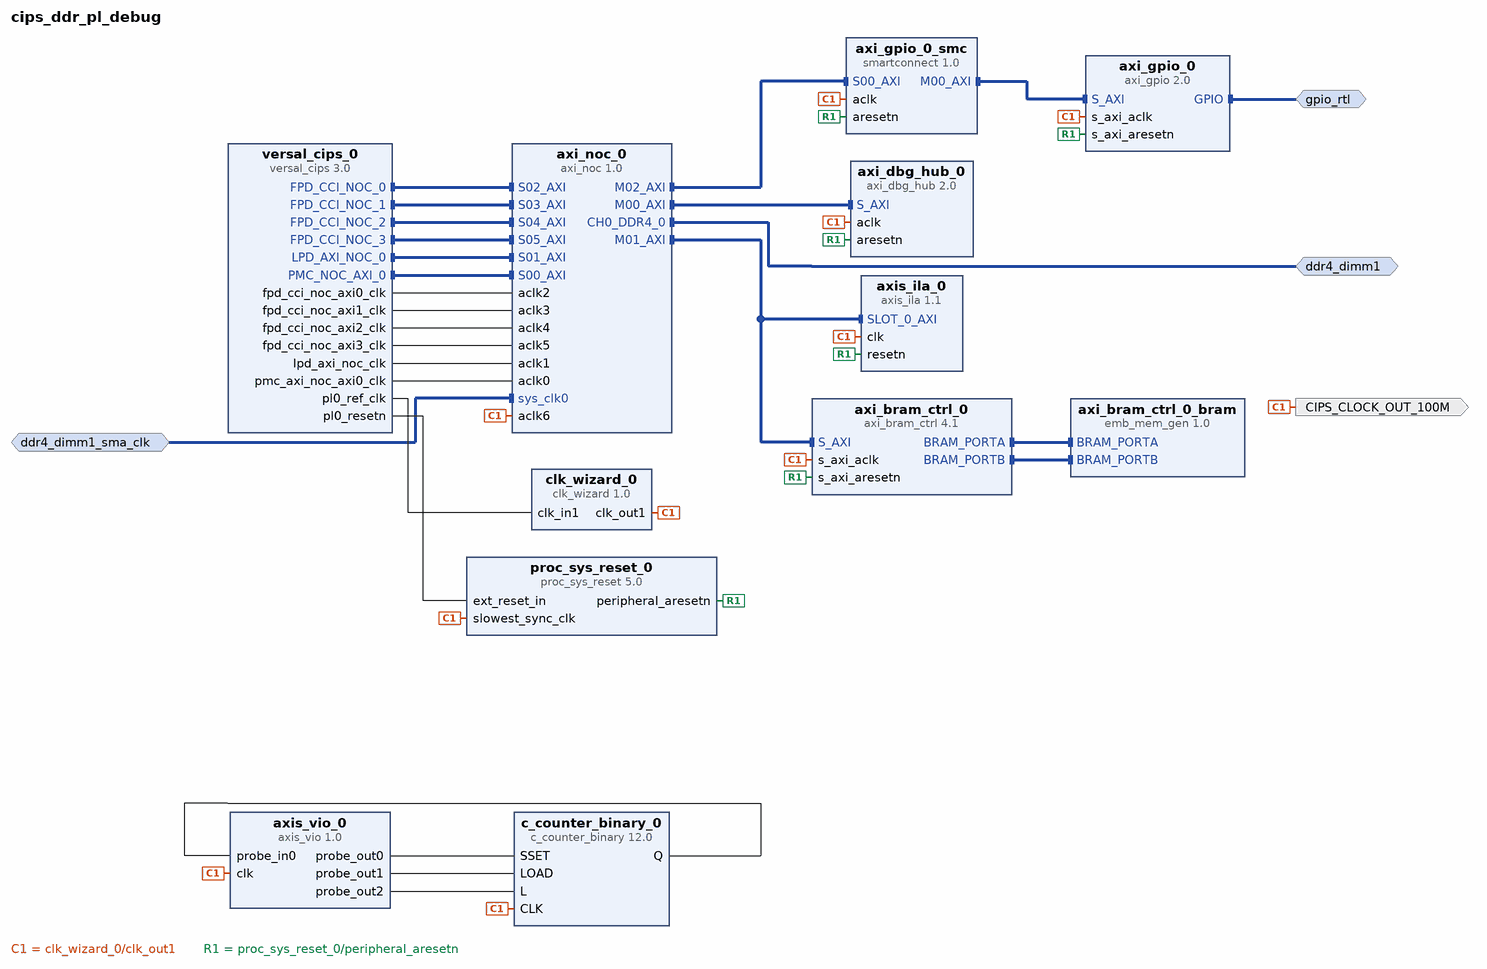
[diagram p0: block diagram of the top level]
# Vivado block design cips_ddr_pl_debug, xcvc1902-vsva2197-2MP-e-S, Vivado 2021.1
create_bd_design cips_ddr_pl_debug

create_bd_intf_port -mode Master -vlnv xilinx.com:interface:ddr4_rtl:1.0 ddr4_dimm1
create_bd_intf_port -mode Slave -vlnv xilinx.com:interface:diff_clock_rtl:1.0 ddr4_dimm1_sma_clk
set_property -dict {CONFIG.FREQ_HZ 200000000} [get_bd_intf_ports ddr4_dimm1_sma_clk]
create_bd_intf_port -mode Master -vlnv xilinx.com:interface:gpio_rtl:1.0 gpio_rtl
create_bd_port -dir O -type clk CIPS_CLOCK_OUT_100M

create_bd_cell -type ip -vlnv xilinx.com:ip:axi_bram_ctrl:4.1 axi_bram_ctrl_0
create_bd_cell -type ip -vlnv xilinx.com:ip:emb_mem_gen:1.0 axi_bram_ctrl_0_bram
set_property -dict {CONFIG.MEMORY_TYPE True_Dual_Port_RAM} [get_bd_cells axi_bram_ctrl_0_bram]
create_bd_cell -type ip -vlnv xilinx.com:ip:axi_dbg_hub:2.0 axi_dbg_hub_0
set_property -dict {CONFIG.C_AXI_DATA_WIDTH 128 CONFIG.C_NUM_DEBUG_CORES 0} [get_bd_cells axi_dbg_hub_0]
create_bd_cell -type ip -vlnv xilinx.com:ip:axi_noc:1.0 axi_noc_0
set_property -dict [list \
  CONFIG.CH0_DDR4_0_BOARD_INTERFACE ddr4_dimm1 \
  CONFIG.NUM_CLKS 7 \
  CONFIG.NUM_MI 3 \
  CONFIG.NUM_SI 6 \
  CONFIG.sys_clk0_BOARD_INTERFACE ddr4_dimm1_sma_clk \
] [get_bd_cells axi_noc_0]
create_bd_cell -type ip -vlnv xilinx.com:ip:axis_ila:1.1 axis_ila_0
set_property -dict [list \
  CONFIG.C_MON_TYPE Interface_Monitor \
  CONFIG.C_SLOT_0_APC_EN 0 \
  CONFIG.C_SLOT_0_AXI_AR_SEL_DATA 1 \
  CONFIG.C_SLOT_0_AXI_AR_SEL_TRIG 1 \
  CONFIG.C_SLOT_0_AXI_AW_SEL_DATA 1 \
  CONFIG.C_SLOT_0_AXI_AW_SEL_TRIG 1 \
  CONFIG.C_SLOT_0_AXI_B_SEL_DATA 1 \
  CONFIG.C_SLOT_0_AXI_B_SEL_TRIG 1 \
  CONFIG.C_SLOT_0_AXI_R_SEL_DATA 1 \
  CONFIG.C_SLOT_0_AXI_R_SEL_TRIG 1 \
  CONFIG.C_SLOT_0_AXI_W_SEL_DATA 1 \
  CONFIG.C_SLOT_0_AXI_W_SEL_TRIG 1 \
] [get_bd_cells axis_ila_0]
create_bd_cell -type ip -vlnv xilinx.com:ip:axis_vio:1.0 axis_vio_0
set_property -dict {CONFIG.C_NUM_PROBE_OUT 3 CONFIG.C_PROBE_IN0_WIDTH 16 CONFIG.C_PROBE_OUT2_WIDTH 16} [get_bd_cells axis_vio_0]
create_bd_cell -type ip -vlnv xilinx.com:ip:c_counter_binary:12.0 c_counter_binary_0
set_property -dict {CONFIG.Load true CONFIG.SSET true} [get_bd_cells c_counter_binary_0]
create_bd_cell -type ip -vlnv xilinx.com:ip:clk_wizard:1.0 clk_wizard_0
set_property -dict {CONFIG.PRIM_SOURCE No_buffer} [get_bd_cells clk_wizard_0]
create_bd_cell -type ip -vlnv xilinx.com:ip:proc_sys_reset:5.0 proc_sys_reset_0
create_bd_cell -type ip -vlnv xilinx.com:ip:versal_cips:3.0 versal_cips_0
set_property -dict [list \
  CONFIG.CLOCK_MODE Custom \
  CONFIG.DDR_MEMORY_MODE Custom \
  CONFIG.PS_BOARD_INTERFACE ps_pmc_fixed_io \
  CONFIG.PS_PMC_CONFIG {PS_GEN_IPI0_ENABLE 1 PS_GEN_IPI0_MASTER A72 PS_GEN_IPI1_ENABLE 1 PS_GEN_IPI1_MASTER A72 PS_GEN_IPI2_ENABLE 1 PS_GEN_IPI2_MASTER A72 PS_GEN_IPI3_ENABLE 1 PS_GEN_IPI3_MASTER A72 PS_GEN_IPI4_ENABLE 1 PS_GEN_IPI4_MASTER A72 PS_GEN_IPI5_ENABLE 1 PS_GEN_IPI5_MASTER A72 PS_GEN_IPI6_ENABLE 1 PS_GEN_IPI6_MASTER A72 CLOCK_MODE Custom DDR_MEMORY_MODE Custom PMC_USE_PMC_NOC_AXI0 1 PS_NUM_FABRIC_RESETS 1 PS_USE_FPD_CCI_NOC 1 PS_USE_NOC_LPD_AXI0 1 PS_USE_PMCPL_CLK0 1 PS_MIO7 {{AUX_IO 0} {DIRECTION in} {DRIVE_STRENGTH 8mA} {OUTPUT_DATA default} {PULL disable} {SCHMITT 0} {SLEW slow} {USAGE Reserved}} PS_MIO9 {{AUX_IO 0} {DIRECTION in} {DRIVE_STRENGTH 8mA} {OUTPUT_DATA default} {PULL disable} {SCHMITT 0} {SLEW slow} {USAGE Reserved}} PS_MIO19 {{AUX_IO 0} {DIRECTION in} {DRIVE_STRENGTH 8mA} {OUTPUT_DATA default} {PULL disable} {SCHMITT 0} {SLEW slow} {USAGE Reserved}} PS_MIO21 {{AUX_IO 0} {DIRECTION in} {DRIVE_STRENGTH 8mA} {OUTPUT_DATA default} {PULL disable} {SCHMITT 0} {SLEW slow} {USAGE Reserved}} PMC_MIO37 {{AUX_IO 0} {DIRECTION out} {DRIVE_STRENGTH 8mA} {OUTPUT_DATA high} {PULL pullup} {SCHMITT 0} {SLEW slow} {USAGE GPIO}} PMC_SD1 {{CD_ENABLE 1} {CD_IO {PMC_MIO 28}} {POW_ENABLE 1} {POW_IO {PMC_MIO 51}} {RESET_ENABLE 0} {RESET_IO {PMC_MIO 1}} {WP_ENABLE 0} {WP_IO {PMC_MIO 1}}} PMC_SD1_COHERENCY 0 PMC_SD1_DATA_TRANSFER_MODE 8Bit PMC_SD1_PERIPHERAL {{ENABLE 1} {IO {PMC_MIO 26 .. 36}}} PMC_SD1_SLOT_TYPE {SD 3.0} PMC_GPIO0_MIO_PERIPHERAL {{ENABLE 1} {IO {PMC_MIO 0 .. 25}}} PMC_GPIO1_MIO_PERIPHERAL {{ENABLE 1} {IO {PMC_MIO 26 .. 51}}} PMC_I2CPMC_PERIPHERAL {{ENABLE 1} {IO {PMC_MIO 46 .. 47}}} PMC_OSPI_PERIPHERAL {{ENABLE 0} {IO {PMC_MIO 0 .. 11}} {MODE Single}} PMC_QSPI_COHERENCY 0 PMC_QSPI_FBCLK {{ENABLE 1} {IO {PMC_MIO 6}}} PMC_QSPI_PERIPHERAL_DATA_MODE x4 PMC_QSPI_PERIPHERAL_ENABLE 1 PMC_QSPI_PERIPHERAL_MODE {Dual Parallel} PS_CAN1_PERIPHERAL {{ENABLE 1} {IO {PMC_MIO 40 .. 41}}} PS_ENET0_MDIO {{ENABLE 1} {IO {PS_MIO 24 .. 25}}} PS_ENET0_PERIPHERAL {{ENABLE 1} {IO {PS_MIO 0 .. 11}}} PS_ENET1_PERIPHERAL {{ENABLE 1} {IO {PS_MIO 12 .. 23}}} PS_I2C1_PERIPHERAL {{ENABLE 1} {IO {PMC_MIO 44 .. 45}}} PS_UART0_PERIPHERAL {{ENABLE 1} {IO {PMC_MIO 42 .. 43}}} PS_USB3_PERIPHERAL {{ENABLE 1} {IO {PMC_MIO 13 .. 25}}} PMC_REF_CLK_FREQMHZ 33.3333 PS_PCIE_RESET {{ENABLE 1} {IO {PMC_MIO 38 .. 39}}} PS_BOARD_INTERFACE ps_pmc_fixed_io SMON_ALARMS Set_Alarms_On SMON_ENABLE_TEMP_AVERAGING 0 SMON_TEMP_AVERAGING_SAMPLES 8 DESIGN_MODE 1 PS_PCIE1_PERIPHERAL_ENABLE 0 PS_PCIE2_PERIPHERAL_ENABLE 0 PCIE_APERTURES_SINGLE_ENABLE 0 PCIE_APERTURES_DUAL_ENABLE 0 } \
] [get_bd_cells versal_cips_0]
create_bd_cell -type ip -vlnv xilinx.com:ip:axi_gpio:2.0 axi_gpio_0
set_property -dict [list \
  CONFIG.C_ALL_OUTPUTS 1 \
  CONFIG.C_GPIO_WIDTH 4 \
  CONFIG.GPIO_BOARD_INTERFACE Custom \
  CONFIG.USE_BOARD_FLOW true \
] [get_bd_cells axi_gpio_0]
create_bd_cell -type ip -vlnv xilinx.com:ip:smartconnect:1.0 axi_gpio_0_smc
set_property -dict {CONFIG.NUM_MI 1 CONFIG.NUM_SI 1} [get_bd_cells axi_gpio_0_smc]

# ---- connections ----

connect_bd_intf_net [get_bd_intf_pins axi_bram_ctrl_0/BRAM_PORTA] [get_bd_intf_pins axi_bram_ctrl_0_bram/BRAM_PORTA]
connect_bd_intf_net [get_bd_intf_pins axi_bram_ctrl_0/BRAM_PORTB] [get_bd_intf_pins axi_bram_ctrl_0_bram/BRAM_PORTB]
connect_bd_intf_net [get_bd_intf_ports gpio_rtl] [get_bd_intf_pins axi_gpio_0/GPIO]
connect_bd_intf_net [get_bd_intf_pins axi_gpio_0/S_AXI] [get_bd_intf_pins axi_gpio_0_smc/M00_AXI]
connect_bd_intf_net [get_bd_intf_ports ddr4_dimm1] [get_bd_intf_pins axi_noc_0/CH0_DDR4_0]
connect_bd_intf_net [get_bd_intf_pins axi_dbg_hub_0/S_AXI] [get_bd_intf_pins axi_noc_0/M00_AXI]
connect_bd_intf_net -intf_net axi_noc_0_M01_AXI [get_bd_intf_pins axi_bram_ctrl_0/S_AXI] [get_bd_intf_pins axi_noc_0/M01_AXI]
connect_bd_intf_net [get_bd_intf_pins axi_bram_ctrl_0/S_AXI] [get_bd_intf_pins axis_ila_0/SLOT_0_AXI]
connect_bd_intf_net [get_bd_intf_pins axi_gpio_0_smc/S00_AXI] [get_bd_intf_pins axi_noc_0/M02_AXI]
connect_bd_intf_net [get_bd_intf_ports ddr4_dimm1_sma_clk] [get_bd_intf_pins axi_noc_0/sys_clk0]
connect_bd_intf_net [get_bd_intf_pins axi_noc_0/S02_AXI] [get_bd_intf_pins versal_cips_0/FPD_CCI_NOC_0]
connect_bd_intf_net [get_bd_intf_pins axi_noc_0/S03_AXI] [get_bd_intf_pins versal_cips_0/FPD_CCI_NOC_1]
connect_bd_intf_net [get_bd_intf_pins axi_noc_0/S04_AXI] [get_bd_intf_pins versal_cips_0/FPD_CCI_NOC_2]
connect_bd_intf_net [get_bd_intf_pins axi_noc_0/S05_AXI] [get_bd_intf_pins versal_cips_0/FPD_CCI_NOC_3]
connect_bd_intf_net [get_bd_intf_pins axi_noc_0/S01_AXI] [get_bd_intf_pins versal_cips_0/LPD_AXI_NOC_0]
connect_bd_intf_net [get_bd_intf_pins axi_noc_0/S00_AXI] [get_bd_intf_pins versal_cips_0/PMC_NOC_AXI_0]
connect_bd_net [get_bd_pins axis_vio_0/probe_out0] [get_bd_pins c_counter_binary_0/SSET]
connect_bd_net [get_bd_pins axis_vio_0/probe_out1] [get_bd_pins c_counter_binary_0/LOAD]
connect_bd_net [get_bd_pins axis_vio_0/probe_out2] [get_bd_pins c_counter_binary_0/L]
connect_bd_net [get_bd_pins c_counter_binary_0/Q] [get_bd_pins axis_vio_0/probe_in0]
connect_bd_net [get_bd_pins clk_wizard_0/clk_out1] \
  [get_bd_ports CIPS_CLOCK_OUT_100M] [get_bd_pins axi_bram_ctrl_0/s_axi_aclk] [get_bd_pins axi_dbg_hub_0/aclk] \
  [get_bd_pins axi_noc_0/aclk6] [get_bd_pins axis_ila_0/clk] [get_bd_pins axis_vio_0/clk] \
  [get_bd_pins c_counter_binary_0/CLK] [get_bd_pins proc_sys_reset_0/slowest_sync_clk] [get_bd_pins axi_gpio_0/s_axi_aclk] \
  [get_bd_pins axi_gpio_0_smc/aclk]
connect_bd_net [get_bd_pins proc_sys_reset_0/peripheral_aresetn] \
  [get_bd_pins axi_bram_ctrl_0/s_axi_aresetn] [get_bd_pins axi_dbg_hub_0/aresetn] [get_bd_pins axis_ila_0/resetn] \
  [get_bd_pins axi_gpio_0/s_axi_aresetn] [get_bd_pins axi_gpio_0_smc/aresetn]
connect_bd_net [get_bd_pins versal_cips_0/fpd_cci_noc_axi0_clk] [get_bd_pins axi_noc_0/aclk2]
connect_bd_net [get_bd_pins versal_cips_0/fpd_cci_noc_axi1_clk] [get_bd_pins axi_noc_0/aclk3]
connect_bd_net [get_bd_pins versal_cips_0/fpd_cci_noc_axi2_clk] [get_bd_pins axi_noc_0/aclk4]
connect_bd_net [get_bd_pins versal_cips_0/fpd_cci_noc_axi3_clk] [get_bd_pins axi_noc_0/aclk5]
connect_bd_net [get_bd_pins versal_cips_0/lpd_axi_noc_clk] [get_bd_pins axi_noc_0/aclk1]
connect_bd_net [get_bd_pins versal_cips_0/pl0_ref_clk] [get_bd_pins clk_wizard_0/clk_in1]
connect_bd_net [get_bd_pins versal_cips_0/pl0_resetn] [get_bd_pins proc_sys_reset_0/ext_reset_in]
connect_bd_net [get_bd_pins versal_cips_0/pmc_axi_noc_axi0_clk] [get_bd_pins axi_noc_0/aclk0]
set_property HDL_ATTRIBUTE.DEBUG true [get_bd_intf_nets axi_noc_0_M01_AXI]
set_property HDL_ATTRIBUTE.MARK_DEBUG true [get_bd_intf_nets axi_noc_0_M01_AXI]

# ---- address map ----
assign_bd_address -offset 0x0000000000000000 -range 2G -target_address_space [get_bd_addr_spaces versal_cips_0/FPD_CCI_NOC_0] [get_bd_addr_segs axi_noc_0/S02_AXI/C0_DDR_LOW0]
assign_bd_address -offset 0x0000020140000000 -range 8K -target_address_space [get_bd_addr_spaces versal_cips_0/FPD_CCI_NOC_0] [get_bd_addr_segs axi_bram_ctrl_0/S_AXI/Mem0]
assign_bd_address -offset 0x00000201C0000000 -range 64K -target_address_space [get_bd_addr_spaces versal_cips_0/FPD_CCI_NOC_0] [get_bd_addr_segs axi_gpio_0/S_AXI/Reg]
assign_bd_address -offset 0x0000000000000000 -range 2G -target_address_space [get_bd_addr_spaces versal_cips_0/FPD_CCI_NOC_1] [get_bd_addr_segs axi_noc_0/S03_AXI/C0_DDR_LOW0]
assign_bd_address -offset 0x0000000000000000 -range 2G -target_address_space [get_bd_addr_spaces versal_cips_0/FPD_CCI_NOC_2] [get_bd_addr_segs axi_noc_0/S04_AXI/C0_DDR_LOW0]
assign_bd_address -offset 0x0000000000000000 -range 2G -target_address_space [get_bd_addr_spaces versal_cips_0/FPD_CCI_NOC_3] [get_bd_addr_segs axi_noc_0/S05_AXI/C0_DDR_LOW0]
assign_bd_address -offset 0x0000000000000000 -range 2G -target_address_space [get_bd_addr_spaces versal_cips_0/LPD_AXI_NOC_0] [get_bd_addr_segs axi_noc_0/S01_AXI/C0_DDR_LOW0]
assign_bd_address -offset 0x0000000000000000 -range 2G -target_address_space [get_bd_addr_spaces versal_cips_0/PMC_NOC_AXI_0] [get_bd_addr_segs axi_noc_0/S00_AXI/C0_DDR_LOW0]
assign_bd_address -offset 0x0000020100000000 -range 2M -target_address_space [get_bd_addr_spaces versal_cips_0/PMC_NOC_AXI_0] [get_bd_addr_segs axi_dbg_hub_0/S_AXI_DBG_HUB/Mem0]

validate_bd_design
save_bd_design
